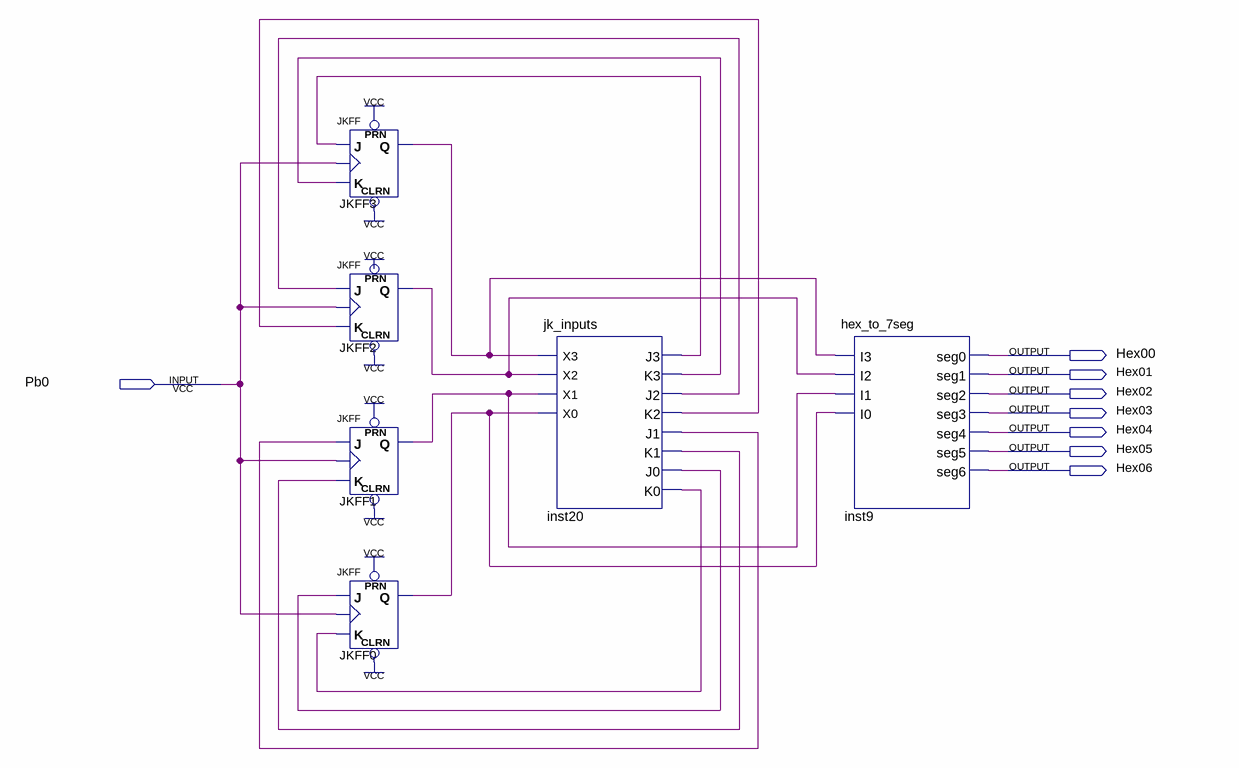
[diagram p0: schematic sheet]
// Quartus schematic lab004.bdf as structural Verilog: 6 symbols, 8 pins
module lab004 (
  input  Pb0,
  output Hex00,
  output Hex01,
  output Hex02,
  output Hex03,
  output Hex04,
  output Hex05,
  output Hex06
);

  wire inst20_j0, inst20_j1, inst20_j2, inst20_j3, inst20_k0, inst20_k1, inst20_k2, inst20_k3, JKFF0_q,
       JKFF1_q, JKFF2_q, JKFF3_q;

  JKFF JKFF3 (.PRN(1'b1), .CLRN(1'b1), .K(inst20_k3), .J(inst20_j3), .CLK(Pb0), .Q(JKFF3_q));
  JKFF JKFF2 (.CLRN(1'b1), .K(inst20_k2), .J(inst20_j2), .CLK(Pb0), .Q(JKFF2_q));  // open: PRN
  JKFF JKFF1 (.PRN(1'b1), .CLRN(1'b1), .K(inst20_k1), .J(inst20_j1), .CLK(Pb0), .Q(JKFF1_q));
  JKFF JKFF0 (.PRN(1'b1), .CLRN(1'b1), .K(inst20_k0), .J(inst20_j0), .CLK(Pb0), .Q(JKFF0_q));
  jk_inputs inst20 (
    .X3(JKFF3_q), .X2(JKFF2_q), .X1(JKFF1_q), .X0(JKFF0_q), .J3(inst20_j3), .K3(inst20_k3), .J2(inst20_j2),
    .K2(inst20_k2), .J1(inst20_j1), .K1(inst20_k1), .J0(inst20_j0), .K0(inst20_k0));
  hex_to_7seg inst9 (
    .I3(JKFF3_q), .I2(JKFF2_q), .I1(JKFF1_q), .I0(JKFF0_q), .seg0(Hex00), .seg1(Hex01), .seg2(Hex02),
    .seg3(Hex03), .seg4(Hex04), .seg5(Hex05), .seg6(Hex06));
endmodule
